# EAGLE design test (EAGLE 5.11)
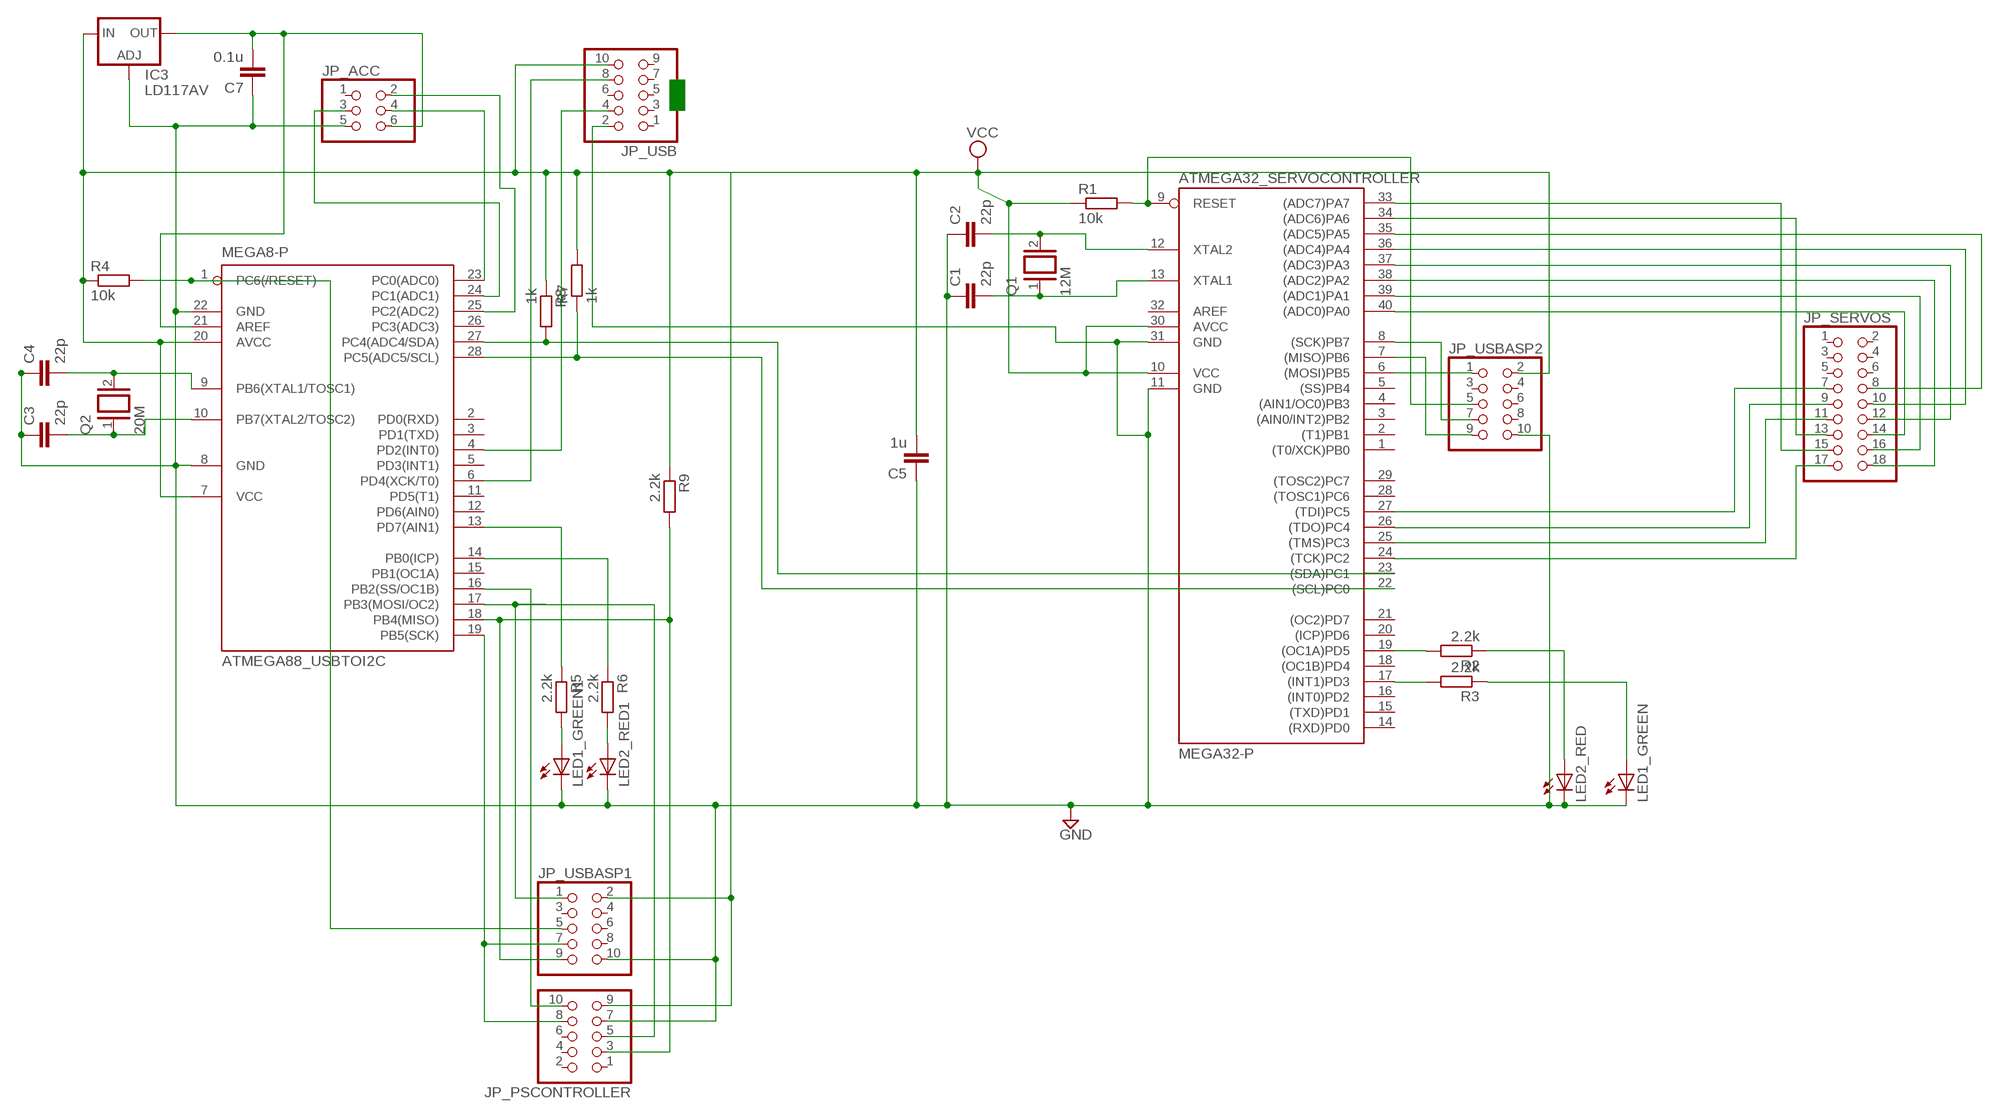
[diagram p0: schematic, sheet 1]

## Parts
ATMEGA32_SERVOCONTROLLER  MEGA32-P  [DIL40]
ATMEGA88_USBTOI2C  MEGA8-P  [DIL28-3]
C1  22p  C-EU025-024X044  [C025-024X044]
C2  22p  C-EU025-024X044  [C025-024X044]
C3  22p  C-EU025-024X044  [C025-024X044]
C4  22p  C-EU025-024X044  [C025-024X044]
C5  1u  C-EU025-024X044  [C025-024X044]
C7  0.1u  C-EU025-024X044  [C025-024X044]
IC3  LD117AV  [TO220L1]
JP_ACC  PINHD-2X3  [2X03]
JP_PSCONTROLLER  PINHD-2X5  [2X05]
JP_SERVOS  PINHD-2X9  [2X09]
JP_USB  PINHD-2X5  [2X05]
JP_USBASP1  PINHD-2X5  [2X05]
JP_USBASP2  PINHD-2X5  [2X05]
LED1_GREEN  LED3MM  [LED3MM]
LED1_GREEN1  LED3MM  [LED3MM]
LED2_RED  LED3MM  [LED3MM]
LED2_RED1  LED3MM  [LED3MM]
Q1  12M  XTAL/S  [QS]
Q2  20M  XTAL/S  [QS]
R1  10k  R-EU_0207/10  [0207/10]
R2  2.2k  R-EU_0207/10  [0207/10]
R3  2.2k  R-EU_0207/10  [0207/10]
R4  10k  R-EU_0207/10  [0207/10]
R5  2.2k  R-EU_0207/10  [0207/10]
R6  2.2k  R-EU_0207/10  [0207/10]
R7  1k  R-EU_0207/10  [0207/10]
R8  1k  R-EU_0207/10  [0207/10]
R9  2.2k  R-EU_0207/10  [0207/10]

## Nets
GND: ATMEGA32_SERVOCONTROLLER.11(GND) ATMEGA32_SERVOCONTROLLER.31(GND) ATMEGA88_USBTOI2C.8(GND) ATMEGA88_USBTOI2C.22(GND) C1.1 C2.1 C3.1 C4.1 C5.1 C7.1 IC3.1(ADJ) JP_ACC.5 JP_PSCONTROLLER.7 JP_USB.2 JP_USBASP1.10 JP_USBASP2.10 LED1_GREEN1.K(C) LED1_GREEN.K(C) LED2_RED1.K(C) LED2_RED.K(C)
N$1: ATMEGA32_SERVOCONTROLLER.17((INT1)PD3) R3.2
N$2: LED1_GREEN.A R3.1
N$3: LED2_RED.A R2.1
N$4: ATMEGA32_SERVOCONTROLLER.19((OC1A)PD5) R2.2
N$5: ATMEGA32_SERVOCONTROLLER.9(RESET) JP_USBASP2.5 R1.2
N$6: ATMEGA32_SERVOCONTROLLER.12(XTAL2) C2.2 Q1.2
N$7: ATMEGA32_SERVOCONTROLLER.13(XTAL1) C1.2 Q1.1
N$8: ATMEGA32_SERVOCONTROLLER.6((MOSI)PB5) JP_USBASP2.1
N$9: ATMEGA32_SERVOCONTROLLER.8((SCK)PB7) JP_USBASP2.7
N$10: ATMEGA32_SERVOCONTROLLER.7((MISO)PB6) JP_USBASP2.9
N$11: ATMEGA32_SERVOCONTROLLER.22((SCL)PC0) ATMEGA88_USBTOI2C.28(PC5(ADC5/SCL)) R7.1
N$12: ATMEGA32_SERVOCONTROLLER.40((ADC0)PA0) JP_SERVOS.14
N$13: ATMEGA32_SERVOCONTROLLER.39((ADC1)PA1) JP_SERVOS.16
N$14: ATMEGA32_SERVOCONTROLLER.38((ADC2)PA2) JP_SERVOS.18
N$15: ATMEGA32_SERVOCONTROLLER.37((ADC3)PA3) JP_SERVOS.12
N$16: ATMEGA32_SERVOCONTROLLER.36((ADC4)PA4) JP_SERVOS.10
N$17: ATMEGA32_SERVOCONTROLLER.35((ADC5)PA5) JP_SERVOS.8
N$18: ATMEGA32_SERVOCONTROLLER.34((ADC6)PA6) JP_SERVOS.13
N$19: ATMEGA32_SERVOCONTROLLER.33((ADC7)PA7) JP_SERVOS.15
N$20: ATMEGA32_SERVOCONTROLLER.24((TCK)PC2) JP_SERVOS.17
N$21: ATMEGA32_SERVOCONTROLLER.25((TMS)PC3) JP_SERVOS.11
N$22: ATMEGA32_SERVOCONTROLLER.26((TDO)PC4) JP_SERVOS.9
N$23: ATMEGA32_SERVOCONTROLLER.27((TDI)PC5) JP_SERVOS.7
N$24: ATMEGA32_SERVOCONTROLLER.23((SDA)PC1) ATMEGA88_USBTOI2C.27(PC4(ADC4/SDA)) R8.2
N$25: ATMEGA88_USBTOI2C.13(PD7(AIN1)) R5.1
N$26: ATMEGA88_USBTOI2C.10(PB7(XTAL2/TOSC2)) C3.2 Q2.1
N$27: ATMEGA88_USBTOI2C.9(PB6(XTAL1/TOSC1)) C4.2 Q2.2
N$28: LED1_GREEN1.A R5.2
N$29: ATMEGA88_USBTOI2C.18(PB4(MISO)) JP_PSCONTROLLER.3 JP_USBASP1.9 R9.2
N$30: ATMEGA88_USBTOI2C.19(PB5(SCK)) JP_PSCONTROLLER.8 JP_USBASP1.7
N$31: ATMEGA88_USBTOI2C.17(PB3(MOSI/OC2)) JP_PSCONTROLLER.5 JP_USBASP1.1
N$32: ATMEGA88_USBTOI2C.1(PC6(/RESET)) JP_USBASP1.5 R4.2
N$33: LED2_RED1.A R6.2
N$34: ATMEGA88_USBTOI2C.14(PB0(ICP)) R6.1
N$35: ATMEGA88_USBTOI2C.16(PB2(SS/OC1B)) JP_PSCONTROLLER.10
N$36: ATMEGA88_USBTOI2C.6(PD4(XCK/T0)) JP_USB.8
N$37: ATMEGA88_USBTOI2C.4(PD2(INT0)) JP_USB.4
N$38: ATMEGA88_USBTOI2C.25(PC2(ADC2)) JP_ACC.2
N$39: ATMEGA88_USBTOI2C.23(PC0(ADC0)) JP_ACC.4
N$40: ATMEGA88_USBTOI2C.24(PC1(ADC1)) JP_ACC.3
N$44: ATMEGA88_USBTOI2C.21(AREF) C7.2 IC3.2(OUT) JP_ACC.6
VCC: ATMEGA32_SERVOCONTROLLER.10(VCC) ATMEGA32_SERVOCONTROLLER.30(AVCC) ATMEGA88_USBTOI2C.7(VCC) ATMEGA88_USBTOI2C.20(AVCC) C5.2 IC3.3(IN) JP_PSCONTROLLER.9 JP_USB.10 JP_USBASP1.2 JP_USBASP2.2 R1.1 R4.1 R7.2 R8.1 R9.1
Unconnected: ATMEGA32_SERVOCONTROLLER.1((T0/XCK)PB0) ATMEGA32_SERVOCONTROLLER.2((T1)PB1) ATMEGA32_SERVOCONTROLLER.3((AIN0/INT2)PB2) ATMEGA32_SERVOCONTROLLER.4((AIN1/OC0)PB3) ATMEGA32_SERVOCONTROLLER.5((SS)PB4) ATMEGA32_SERVOCONTROLLER.14((RXD)PD0) ATMEGA32_SERVOCONTROLLER.15((TXD)PD1) ATMEGA32_SERVOCONTROLLER.16((INT0)PD2) ATMEGA32_SERVOCONTROLLER.18((OC1B)PD4) ATMEGA32_SERVOCONTROLLER.20((ICP)PD6) ATMEGA32_SERVOCONTROLLER.21((OC2)PD7) ATMEGA32_SERVOCONTROLLER.28((TOSC1)PC6) ATMEGA32_SERVOCONTROLLER.29((TOSC2)PC7) ATMEGA32_SERVOCONTROLLER.32(AREF) ATMEGA88_USBTOI2C.2(PD0(RXD)) ATMEGA88_USBTOI2C.3(PD1(TXD)) ATMEGA88_USBTOI2C.5(PD3(INT1)) ATMEGA88_USBTOI2C.11(PD5(T1)) ATMEGA88_USBTOI2C.12(PD6(AIN0)) ATMEGA88_USBTOI2C.15(PB1(OC1A)) ATMEGA88_USBTOI2C.26(PC3(ADC3)) JP_ACC.1 JP_PSCONTROLLER.1 JP_PSCONTROLLER.2 JP_PSCONTROLLER.4 JP_PSCONTROLLER.6 JP_SERVOS.1 JP_SERVOS.2 JP_SERVOS.3 JP_SERVOS.4 JP_SERVOS.5 JP_SERVOS.6 JP_USB.1 JP_USB.3 JP_USB.5 JP_USB.6 JP_USB.7 JP_USB.9 JP_USBASP1.3 JP_USBASP1.4 JP_USBASP1.6 JP_USBASP1.8 JP_USBASP2.3 JP_USBASP2.4 JP_USBASP2.6 JP_USBASP2.8

## Library data of the parts
ATMEGA32_SERVOCONTROLLER = atmel:MEGA32-P: MICROCONTROLLER 32 Kbytes FLASH 2 Kbytes SRAM 1 Kbytes EEPROM USART 8-channel 10 bit ADC Source: www.atmel.com .. doc2503.pdf; MPN: ATMEGA32-16PU; OC_FARNELL: 1661729; OC_NEWARK: 51P1794
ATMEGA88_USBTOI2C = atmel:MEGA8-P: MICROCONTROLLER 8 Kbytes FLASH, 1 kbytes SRAM, 512 bytes EEPROM, USART, 4-channel 10 bit ADC, 2-channel 8 bit ADC Pin compatible with Atmega48, ATMega88, ATMega168 Source: avr.lbr; OC_FARNELL: unknown; OC_NEWARK: unknown
C1-C5 C7 = resistor:C-EU: CAPACITOR, European symbol
IC3 = v-reg:LD117A?*: Low drop fixed and adjustable positive voltage regulators 1 A Source: http://www.st.com/stonline/products/literature/ds/7194/ld1117axx.pdf
JP_ACC = pinhead:PINHD-2X3: PIN HEADER
JP_PSCONTROLLER JP_USB JP_USBASP1 JP_USBASP2 = pinhead:PINHD-2X5: PIN HEADER
JP_SERVOS = pinhead:PINHD-2X9: PIN HEADER
LED1_GREEN LED1_GREEN1 LED2_RED LED2_RED1 = led:LED: LED OSRAM: - CHIPLED LG R971, LG N971, LY N971, LG Q971, LY Q971, LO R971, LY R971 LH N974, LH R974 LS Q976, LO Q976, LY Q976 LO Q996 - Hyper CHIPLED LW Q18S LB Q993, LB Q99A, LB R99A - SideLED LS A670, LO A670, LY A670, LG A670, LP A670 LB A673, LV A673, LT A673, LW A673 LH A674 LY A675 LS A676, LA A676, LO A676, LY A676, LW A676 LS A679, LY A679, LG A679 - Hyper Micro SIDELED® LS Y876, LA Y876, LO Y876, LY Y876 LT Y87S - SmartLED LW L88C, LW L88S LB L89C, LB L89S, LG L890 LS L89K, LO L89K, LY L89K LS L896, LA L896, LO L896, LY L896 - TOPLED LS T670, LO T670, LY T670, LG T670, LP T670 LSG T670, LSP T670, LSY T670, LOP T670, LYG T670 LG T671, LOG T671, LSG T671 LB T673, LV T673, LT T673, LW T673 LH T674 LS T676, LA T676, LO T676, LY T676, LB T676, LH T676, LSB T676, LW T676 LB T67C, LV T67C, LT T67C, LS T67K, LO T67K, LY T67K, LW E67C LS E67B, LA E67B, LO E67B, LY E67B, LB E67C, LV E67C, LT E67C LW T67C LS T679, LY T679, LG T679 LS T770, LO T770, LY T770, LG T770, LP T770 LB T773, LV T773, LT T773, LW T773 LH T774 LS E675, LA E675, LY E675, LS T675 LS T776, LA T776, LO T776, LY T776, LB T776 LHGB T686 LT T68C, LB T68C - Hyper Mini TOPLED® LB M676 - Mini TOPLED Santana® LG M470 LS M47K, LO M47K, LY M47K Source: http://www.osram.convergy.de LUXEON: - LUMILED® LXK2-PW12-R00, LXK2-PW12-S00, LXK2-PW14-U00, LXK2-PW14-V00 LXK2-PM12-R00, LXK2-PM12-S00, LXK2-PM14-U00 LXK2-PE12-Q00, LXK2-PE12-R00, LXK2-PE12-S00, LXK2-PE14-T00, LXK2-PE14-U00 LXK2-PB12-K00, LXK2-PB12-L00, LXK2-PB12-M00, LXK2-PB14-N00, LXK2-PB14-P00, LXK2-PB14-Q00 LXK2-PR12-L00, LXK2-PR12-M00, LXK2-PR14-Q00, LXK2-PR14-R00 LXK2-PD12-Q00, LXK2-PD12-R00, LXK2-PD12-S00 LXK2-PH12-R00, LXK2-PH12-S00 LXK2-PL12-P00, LXK2-PL12-Q00, LXK2-PL12-R00 Source: www.luxeon.com KINGBRIGHT: KA-3528ASYC Source: www.kingbright.com
Q1 Q2 = special:XTAL/S: CRYSTAL
R1-R9 = resistor:R-EU_: RESISTOR, European symbol

## Board
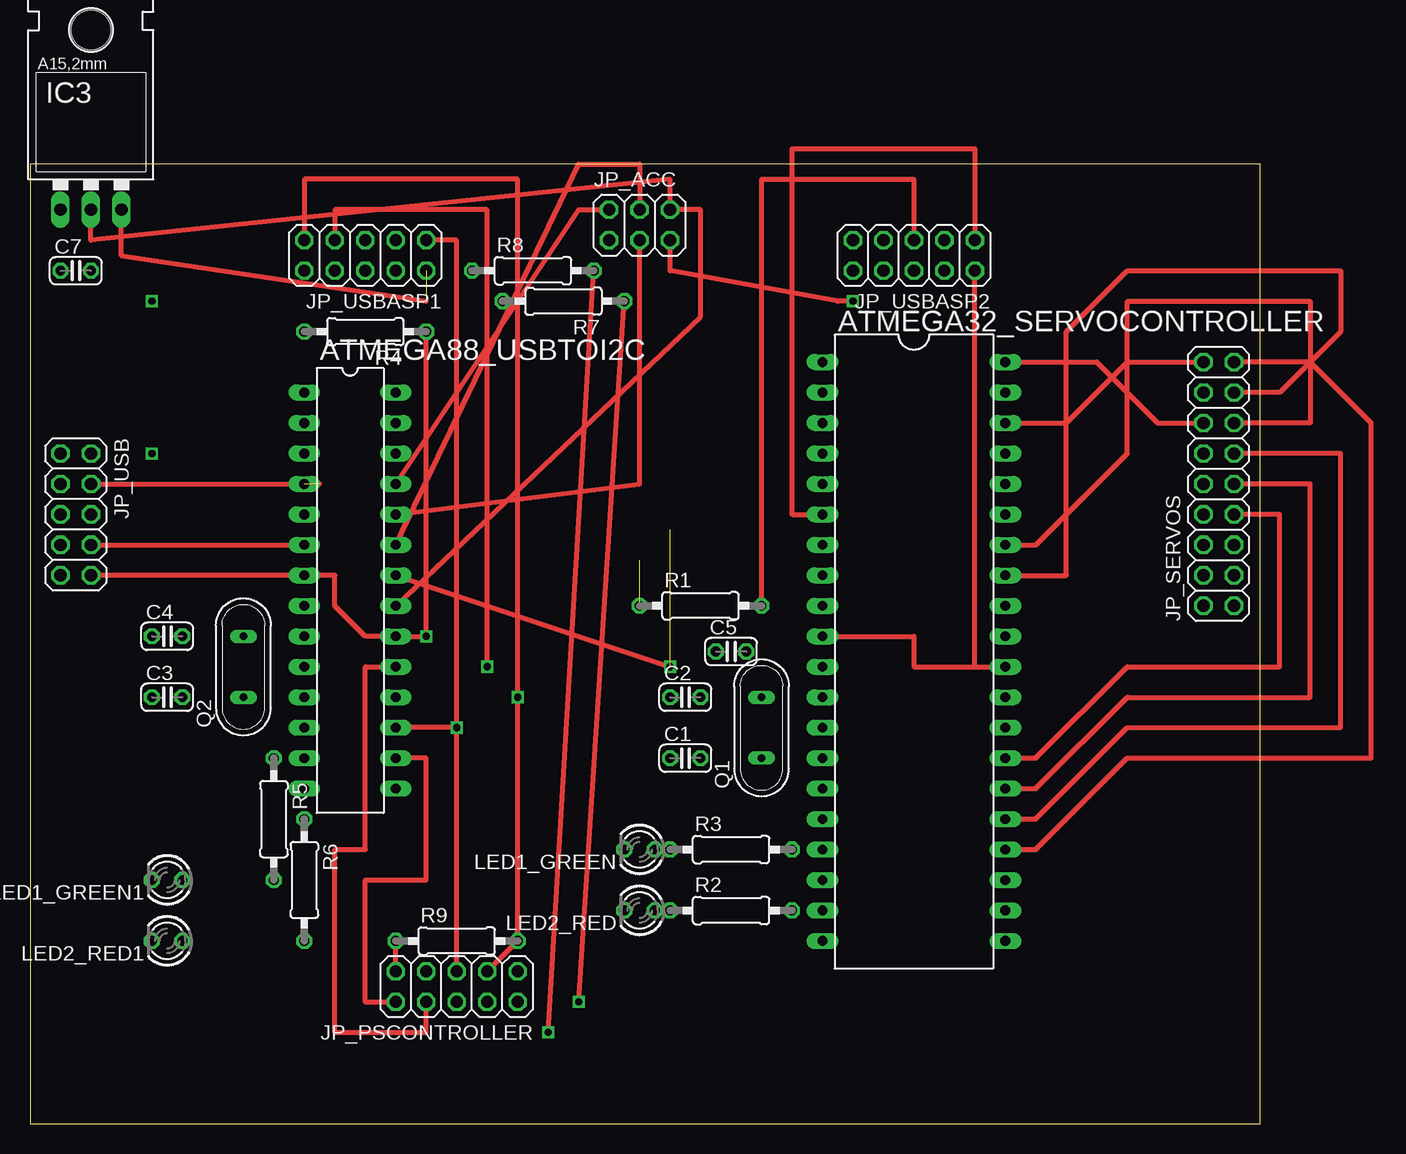
[diagram p1: board, top side]
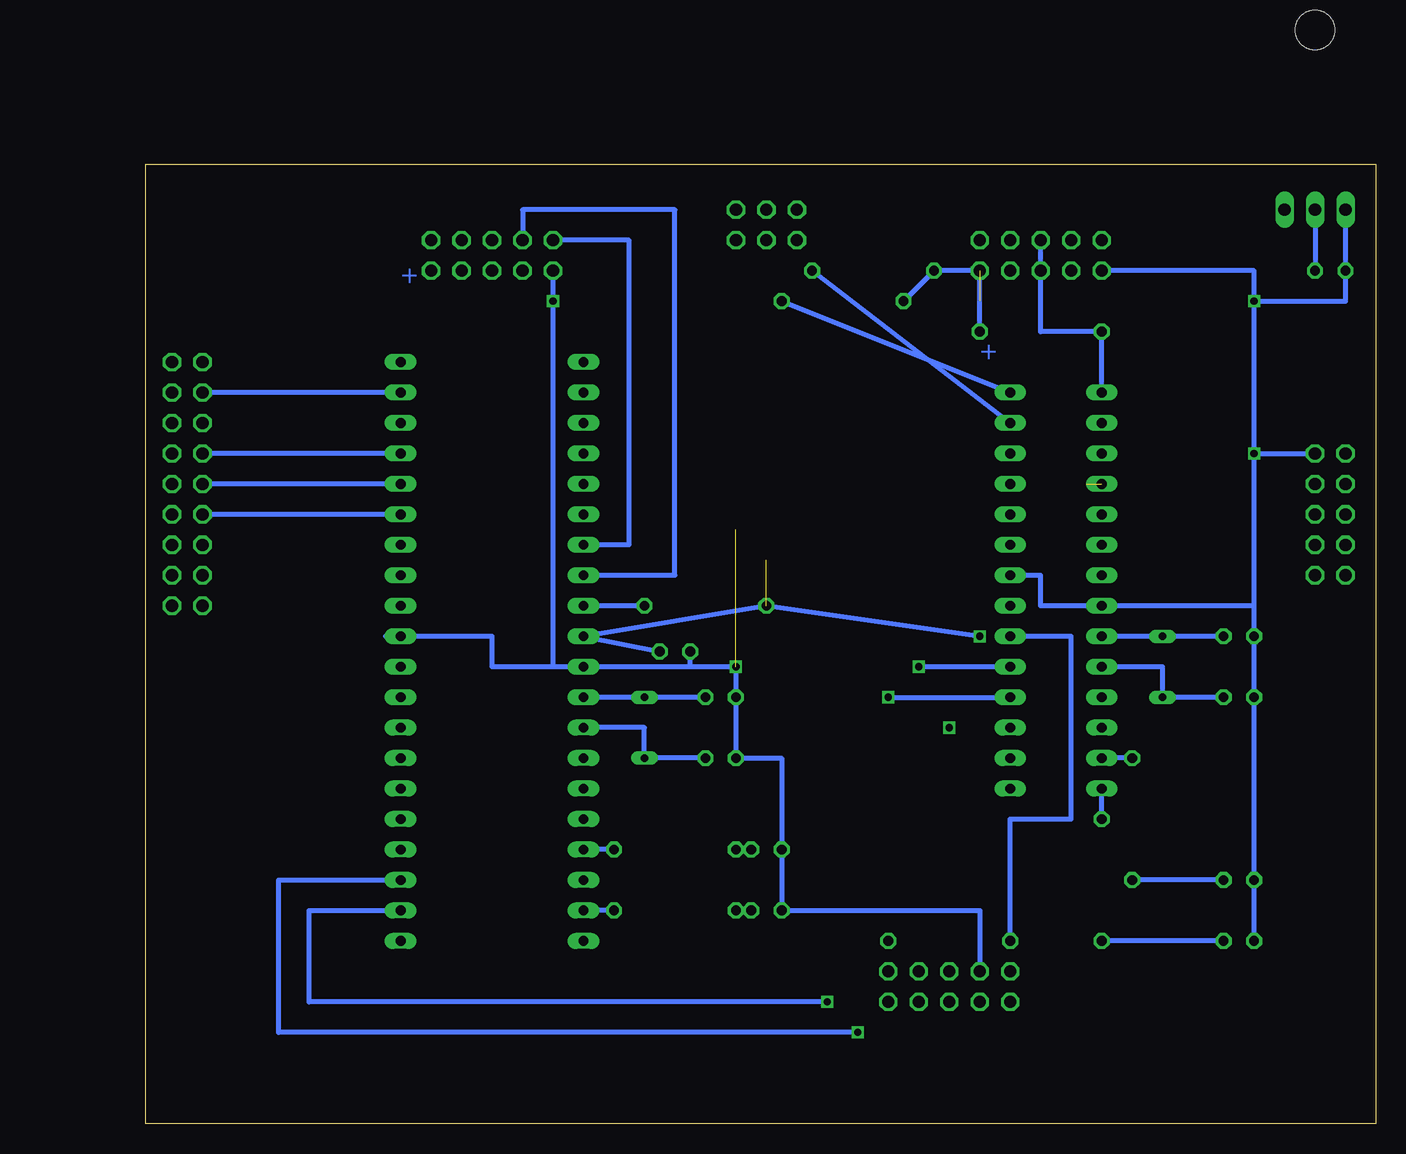
[diagram p2: board, bottom side, seen from below]

Size 102.54 x 80 mm. Coordinates in mm from the lower left corner, seen from the top.
Outline: 0,0 102.54,0 102.54,80 0,80 0,0
Copper layers (1*16): Top 0.035mm / dielectric 1.5mm / Bottom 0.035mm
Design rules "default": minimum track width 10mil, minimum drill 24mil, track to track 8mil, track to pad 8mil, pad to pad 8mil, via to via 8mil, smd to smd 8mil, copper to edge 40mil, drill to drill 8mil, minimum pad ring 10mil, minimum via ring 8mil, stop-mask expansion 4mil, vias tented up to drill 0mil, thermal gap 10mil

### Footprints (pad centres in the part's own frame; a part is rotated, then mirrored left to right if it is on the bottom)
DIL40 = drill 0.813 long: 1 -24.13,-7.62; 2 -21.59,-7.62; 3 -19.05,-7.62; 4 -16.51,-7.62; 5 -13.97,-7.62; 6 -11.43,-7.62; 7 -8.89,-7.62; 8 -6.35,-7.62; 9 -3.81,-7.62; 10 -1.27,-7.62; 11 1.27,-7.62; 12 3.81,-7.62; 13 6.35,-7.62; 14 8.89,-7.62; 15 11.43,-7.62; 16 13.97,-7.62; 17 16.51,-7.62; 18 19.05,-7.62; 19 21.59,-7.62; 20 24.13,-7.62; 21 24.13,7.62; 22 21.59,7.62; 23 19.05,7.62; 24 16.51,7.62; 25 13.97,7.62; 26 11.43,7.62; 27 8.89,7.62; 28 6.35,7.62; 29 3.81,7.62; 30 1.27,7.62; 31 -1.27,7.62; 32 -3.81,7.62; 33 -6.35,7.62; 34 -8.89,7.62; 35 -11.43,7.62; 36 -13.97,7.62; 37 -16.51,7.62; 38 -19.05,7.62; 39 -21.59,7.62; 40 -24.13,7.62
DIL28-3 = drill 0.813 long: 1 -16.51,-3.81; 2 -13.97,-3.81; 3 -11.43,-3.81; 4 -8.89,-3.81; 5 -6.35,-3.81; 6 -3.81,-3.81; 7 -1.27,-3.81; 8 1.27,-3.81; 9 3.81,-3.81; 10 6.35,-3.81; 11 8.89,-3.81; 12 11.43,-3.81; 13 13.97,-3.81; 14 16.51,-3.81; 15 16.51,3.81; 16 13.97,3.81; 17 11.43,3.81; 18 8.89,3.81; 19 6.35,3.81; 20 3.81,3.81; 21 1.27,3.81; 22 -1.27,3.81; 23 -3.81,3.81; 24 -6.35,3.81; 25 -8.89,3.81; 26 -11.43,3.81; 27 -13.97,3.81; 28 -16.51,3.81
C025-024X044 = drill 0.813 octagon: 1 -1.27,0; 2 1.27,0
TO220L1 = drill 1.016 long: 1 -2.54,-3.81; 2 0,-3.81; 3 2.54,-3.81 | hole 3.302: 0,11.176
2X03 = drill 1.016 octagon: 1 -2.54,-1.27; 2 -2.54,1.27; 3 0,-1.27; 4 0,1.27; 5 2.54,-1.27; 6 2.54,1.27
2X05 = drill 1.016 octagon: 1 -5.08,-1.27; 2 -5.08,1.27; 3 -2.54,-1.27; 4 -2.54,1.27; 5 0,-1.27; 6 0,1.27; 7 2.54,-1.27; 8 2.54,1.27; 9 5.08,-1.27; 10 5.08,1.27
2X09 = drill 1.016 octagon: 1 -10.16,-1.27; 2 -10.16,1.27; 3 -7.62,-1.27; 4 -7.62,1.27; 5 -5.08,-1.27; 6 -5.08,1.27; 7 -2.54,-1.27; 8 -2.54,1.27; 9 0,-1.27; 10 0,1.27; 11 2.54,-1.27; 12 2.54,1.27; 13 5.08,-1.27; 14 5.08,1.27; 15 7.62,-1.27; 16 7.62,1.27; 17 10.16,-1.27; 18 10.16,1.27
LED3MM = drill 0.813 octagon: A -1.27,0; K 1.27,0
QS = drill 0.61 long: 1 -2.54,0; 2 2.54,0
0207/10 = drill 0.813 octagon: 1 -5.08,0; 2 5.08,0

### Placement (x,y rotation side)
ATMEGA32_SERVOCONTROLLER  73.66,39.37 270 top
ATMEGA88_USBTOI2C  26.67,44.45 270 top
C1  54.61,30.48 0 top
C2  54.61,35.56 0 top
C3  11.43,35.56 0 top
C4  11.43,40.64 0 top
C5  58.42,39.37 0 top
C7  3.81,71.12 0 top
IC3  5.08,80.01 0 top
JP_ACC  50.8,74.93 0 top
JP_PSCONTROLLER  35.56,11.43 180 top
JP_SERVOS  99.06,53.34 90 top
JP_USB  3.81,50.8 270 top
JP_USBASP1  27.94,72.39 180 top
JP_USBASP2  73.66,72.39 180 top
LED1_GREEN  50.8,22.86 180 top
LED1_GREEN1  11.43,20.32 180 top
LED2_RED  50.8,17.78 180 top
LED2_RED1  11.43,15.24 180 top
Q1  60.96,33.02 90 top
Q2  17.78,38.1 90 top
R1  55.88,43.18 0 top
R2  58.42,17.78 0 top
R3  58.42,22.86 0 top
R4  27.94,66.04 180 top
R5  20.32,25.4 270 top
R6  22.86,20.32 270 top
R7  44.45,68.58 180 top
R8  41.91,71.12 0 top
R9  35.56,15.24 0 top

### Tracks (layer width: path | path; a pad name or v marks a point on that pad's centre or on a via)
GND  (via drill 0.6)  (1 unrouted)
  Top 0.406: ATMEGA88_USBTOI2C.22 v53.34,38.1 | JP_ACC.5 53.34,71.12 67.31,68.58 v68.58,68.58
  Bottom 0.406: C2.1 53.34,31.75 | C2.1 C1.1 49.53,30.48 LED1_GREEN.K LED2_RED.K 33.02,17.78 JP_PSCONTROLLER.7 | 57.15,38.1 v53.34,38.1 C2.1 | 57.15,38.1 ATMEGA32_SERVOCONTROLLER.11 68.58,38.1 | 68.58,38.1 73.66,38.1 73.66,40.64 ATMEGA32_SERVOCONTROLLER.31 82.55,40.64 | 68.58,38.1 v68.58,68.58 JP_USBASP2.10 | LED2_RED1.K LED1_GREEN1.K C3.1 C4.1 10.16,43.18 | 10.16,43.18 ATMEGA88_USBTOI2C.8 27.94,43.18 27.94,45.72 ATMEGA88_USBTOI2C.22 | 10.16,43.18 v10.16,55.88 | v10.16,55.88 JP_USB.2 | 57.15,38.1 C5.1 | IC3.1 C7.1 2.54,68.58 v10.16,68.58 | v10.16,55.88 v10.16,68.58 | v10.16,68.58 10.16,71.12 JP_USBASP1.10
N$1
  Bottom 0.406: R3.2 ATMEGA32_SERVOCONTROLLER.17
N$2
  Bottom 0.406: LED1_GREEN.A R3.1
N$3
  Bottom 0.406: LED2_RED.A R2.1
N$4
  Bottom 0.406: R2.2 ATMEGA32_SERVOCONTROLLER.19
N$5
  Top 0.406: JP_USBASP2.5 73.66,78.74 60.96,78.74 R1.2
  Bottom 0.406: R1.2 ATMEGA32_SERVOCONTROLLER.9
N$6
  Bottom 0.406: C2.2 Q1.2 ATMEGA32_SERVOCONTROLLER.12
N$7
  Bottom 0.406: ATMEGA32_SERVOCONTROLLER.13 60.96,33.02 Q1.1 C1.2
N$8
  Top 0.406: ATMEGA32_SERVOCONTROLLER.6 63.5,50.8 63.5,81.28 78.74,81.28 JP_USBASP2.1
N$9
  Bottom 0.406: ATMEGA32_SERVOCONTROLLER.8 58.42,45.72 58.42,76.2 71.12,76.2 JP_USBASP2.7
N$10
  Bottom 0.406: JP_USBASP2.9 62.23,73.66 62.23,48.26 ATMEGA32_SERVOCONTROLLER.7
N$11  (via drill 0.6)
  Top 0.406: v45.72,10.16 R7.1
  Bottom 0.406: ATMEGA32_SERVOCONTROLLER.22 88.9,17.78 88.9,10.16 v45.72,10.16 | R7.1 ATMEGA88_USBTOI2C.28
N$12
  Top 0.406: ATMEGA32_SERVOCONTROLLER.40 88.9,63.5 93.98,58.42 JP_SERVOS.14
N$13
  Bottom 0.406: ATMEGA32_SERVOCONTROLLER.39 JP_SERVOS.16
N$14
  Top 0.406: JP_SERVOS.18 91.44,63.5 86.36,58.42 ATMEGA32_SERVOCONTROLLER.38
N$15
  Bottom 0.406: ATMEGA32_SERVOCONTROLLER.37 JP_SERVOS.12
N$16
  Bottom 0.406: ATMEGA32_SERVOCONTROLLER.36 JP_SERVOS.10
N$17
  Bottom 0.406: ATMEGA32_SERVOCONTROLLER.35 JP_SERVOS.8
N$18
  Top 0.406: JP_SERVOS.13 106.68,58.42 106.68,68.58 91.44,68.58 91.44,55.88 83.82,48.26 ATMEGA32_SERVOCONTROLLER.34
N$19
  Top 0.406: ATMEGA32_SERVOCONTROLLER.33 86.36,45.72 86.36,66.04 91.44,71.12 109.22,71.12 109.22,66.04 104.14,60.96 JP_SERVOS.15
N$20
  Top 0.406: ATMEGA32_SERVOCONTROLLER.24 83.82,22.86 91.44,30.48 111.76,30.48 111.76,58.42 106.68,63.5 JP_SERVOS.17
N$21
  Top 0.406: JP_SERVOS.11 109.22,55.88 109.22,33.02 91.44,33.02 83.82,25.4 ATMEGA32_SERVOCONTROLLER.25
N$22
  Top 0.406: JP_SERVOS.9 106.68,53.34 106.68,35.56 91.44,35.56 83.82,27.94 ATMEGA32_SERVOCONTROLLER.26
N$23
  Top 0.406: JP_SERVOS.7 104.14,50.8 104.14,38.1 91.44,38.1 83.82,30.48 ATMEGA32_SERVOCONTROLLER.27
N$24  (via drill 0.6)
  Top 0.406: v43.18,7.62 R8.2
  Bottom 0.406: ATMEGA32_SERVOCONTROLLER.23 91.44,20.32 91.44,7.62 v43.18,7.62 | R8.2 ATMEGA88_USBTOI2C.27
N$25
  Bottom 0.406: R5.1 ATMEGA88_USBTOI2C.13
N$26
  Bottom 0.406: ATMEGA88_USBTOI2C.10 17.78,38.1 Q2.1 C3.2
N$27
  Bottom 0.406: ATMEGA88_USBTOI2C.9 Q2.2 C4.2
N$28
  Bottom 0.406: LED1_GREEN1.A R5.2
N$29  (via drill 0.6)
  Top 0.406: JP_PSCONTROLLER.3 R9.2 v40.64,35.56 40.64,78.74 22.86,78.74 JP_USBASP1.9
  Bottom 0.406: v40.64,35.56 ATMEGA88_USBTOI2C.18
N$30  (via drill 0.6)
  Top 0.406: JP_PSCONTROLLER.8 33.02,7.62 25.4,7.62 25.4,22.86 27.94,22.86 27.94,38.1 ATMEGA88_USBTOI2C.19 | JP_USBASP1.7 25.4,76.2 38.1,76.2 v38.1,38.1
  Bottom 0.406: ATMEGA88_USBTOI2C.19 v38.1,38.1
N$31  (via drill 0.6)
  Top 0.406: JP_USBASP1.1 35.56,73.66 v35.56,33.02 | v35.56,33.02 ATMEGA88_USBTOI2C.17 | JP_PSCONTROLLER.5 v35.56,33.02
N$32
  Bottom 0.406: ATMEGA88_USBTOI2C.1 R4.2 27.94,66.04 JP_USBASP1.5
N$33
  Bottom 0.406: LED2_RED1.A R6.2
N$34
  Bottom 0.406: R6.1 ATMEGA88_USBTOI2C.14
N$35
  Top 0.406: ATMEGA88_USBTOI2C.16 33.02,30.48 33.02,20.32 27.94,20.32 27.94,10.16 JP_PSCONTROLLER.10
N$36
  Top 0.406: JP_USB.8 ATMEGA88_USBTOI2C.6
N$37  (1 unrouted)
  Top 0.406: JP_USB.4 24.13,53.34
N$38
  Top 0.406: ATMEGA88_USBTOI2C.25 45.72,76.2 JP_ACC.2
N$39
  Top 0.406: JP_ACC.4 50.8,80.01 45.72,80.01 ATMEGA88_USBTOI2C.23
N$40
  Top 0.406: JP_ACC.3 50.8,53.34 ATMEGA88_USBTOI2C.24
N$44
  Top 0.406: IC3.2 5.08,73.66 53.34,78.74 JP_ACC.6 55.88,76.2 55.88,67.31 ATMEGA88_USBTOI2C.21
  Bottom 0.406: IC3.2 C7.2
VCC  (via drill 0.6)  (2 unrouted)
  Top 0.406: ATMEGA32_SERVOCONTROLLER.10 73.66,40.64 73.66,38.1 78.74,38.1 | 78.74,38.1 ATMEGA32_SERVOCONTROLLER.30 | 78.74,38.1 JP_USBASP2.2 | JP_PSCONTROLLER.9 R9.1 | R4.1 v33.02,40.64 ATMEGA88_USBTOI2C.20 27.94,40.64 25.4,43.18 25.4,45.72 ATMEGA88_USBTOI2C.7 JP_USB.10 | IC3.3 7.62,72.39 33.02,68.58
  Bottom 0.406: R7.2 R8.1 JP_USBASP1.2 R4.1 | R9.1 30.48,25.4 25.4,25.4 25.4,40.64 ATMEGA88_USBTOI2C.20 | v33.02,40.64 R1.1 ATMEGA32_SERVOCONTROLLER.10 C5.2

### Text on the board
Bottom: + | +